# Altium schematic sheet A1.SchDoc
size A3; SheetNumber: 2; SheetTotal: 6
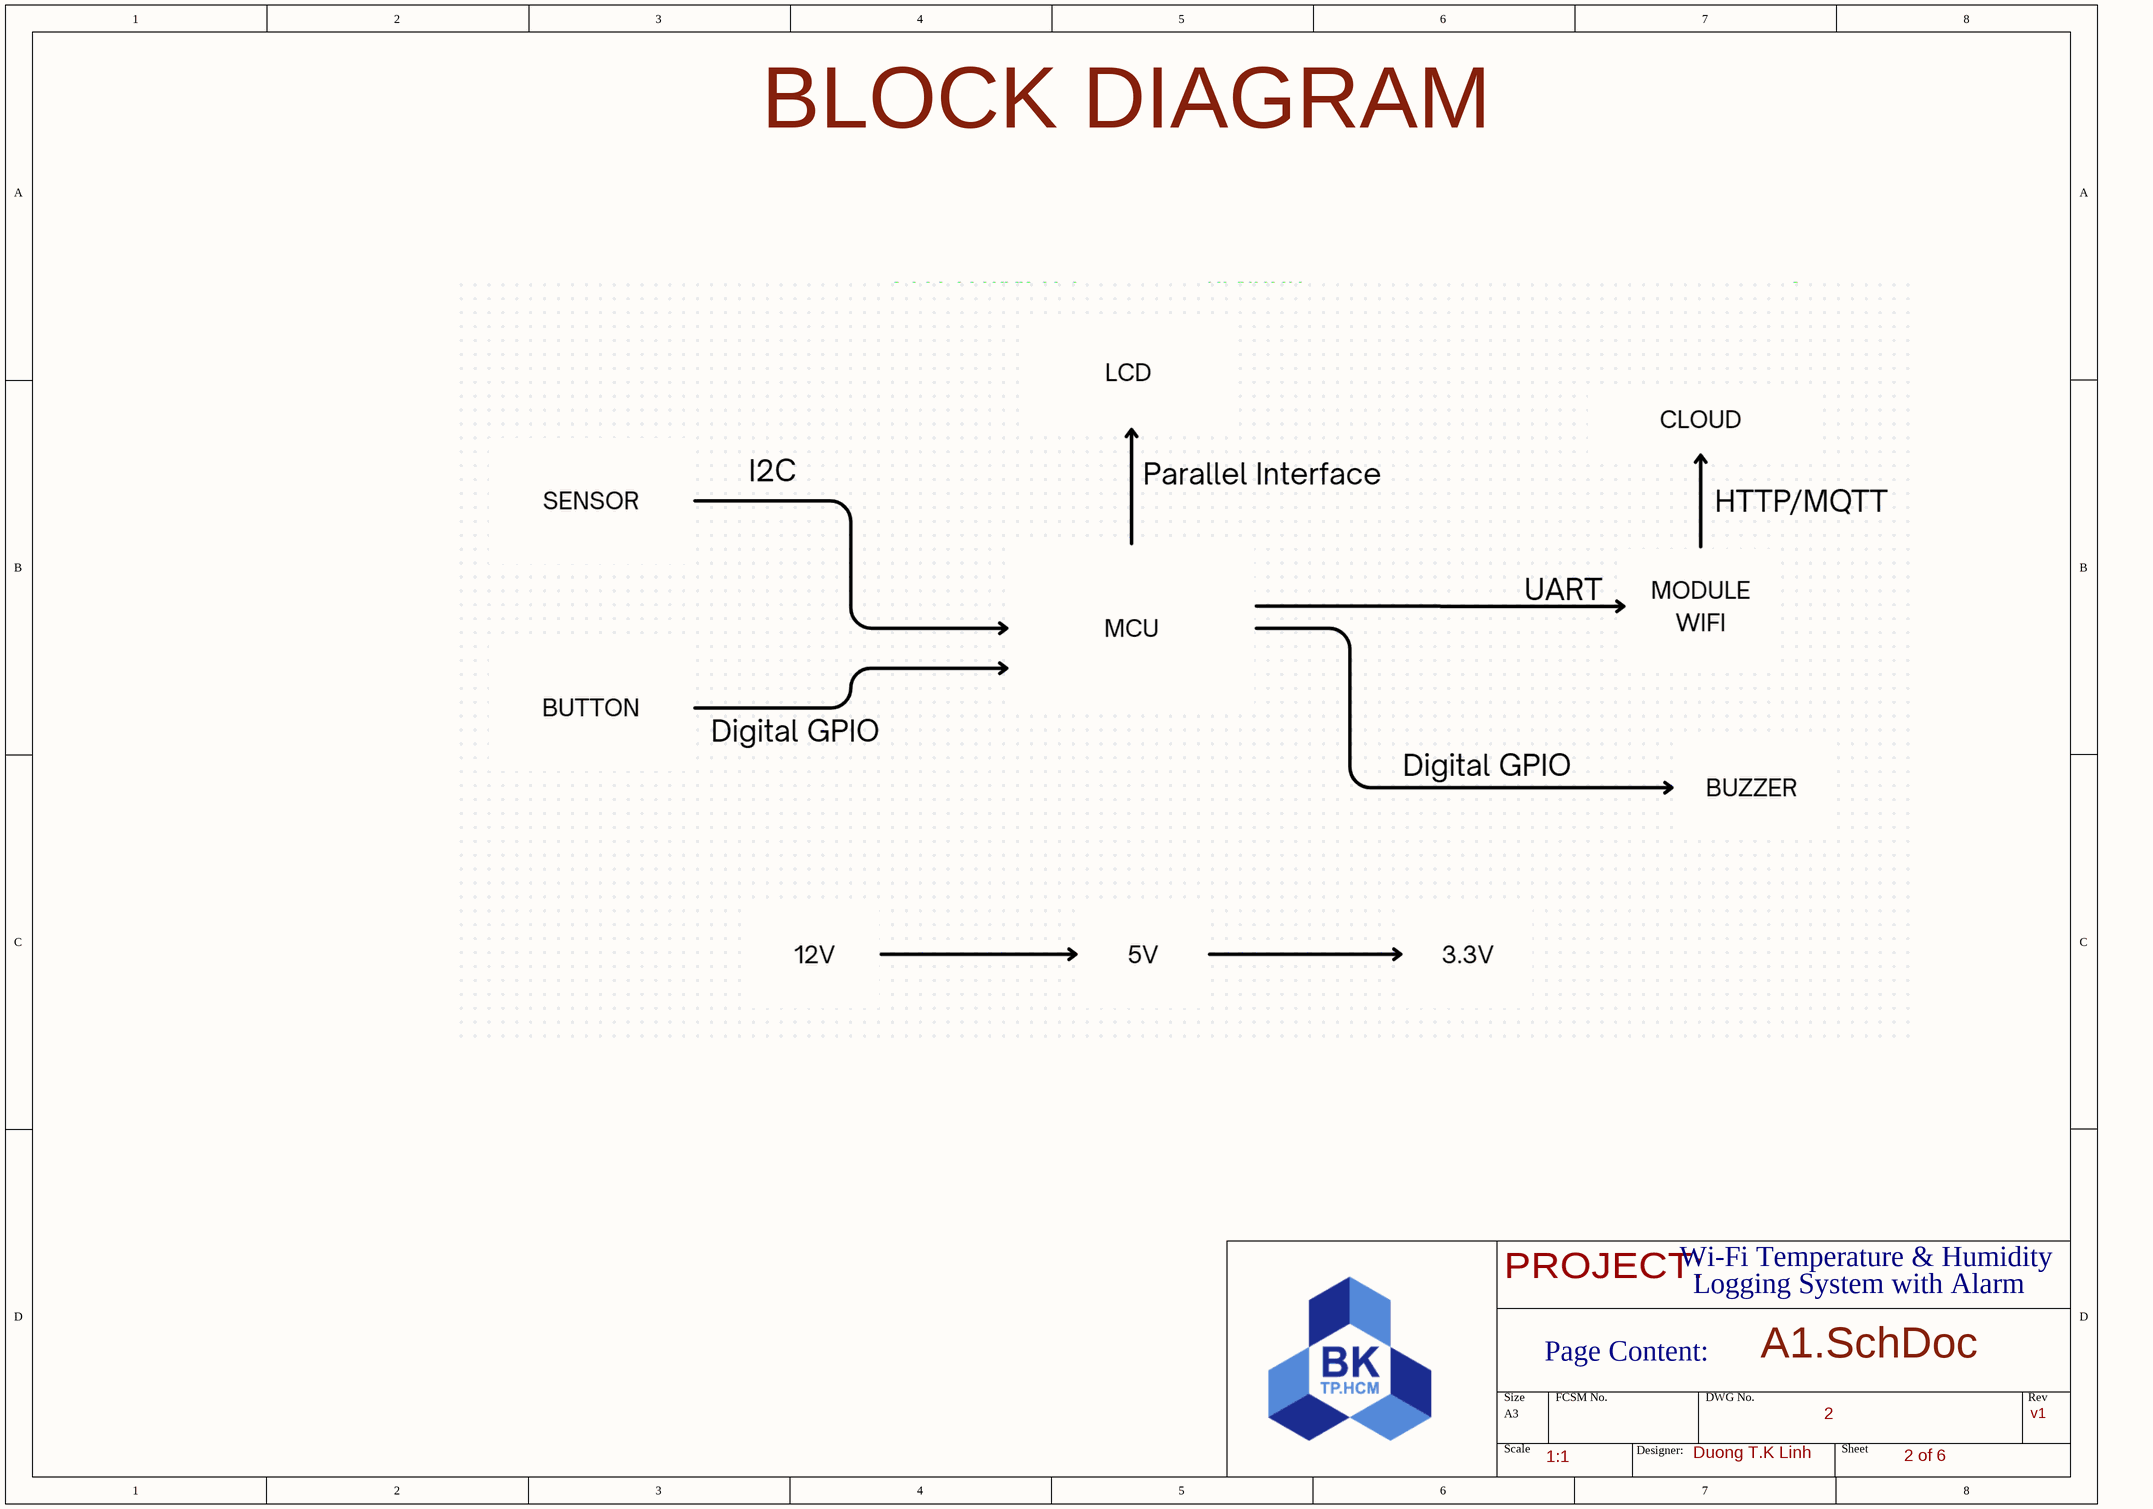
[diagram p0: A1.SchDoc]

## Notes on the sheet
- BLOCK DIAGRAM
- PROJECT:
- Wi-Fi Temperature & Humidity
- Logging System with Alarm
- Page Content:
- A1.SchDoc
- 1:1
- Designer:
- Duong T.K Linh
- 2
- 2 of 6
- v1